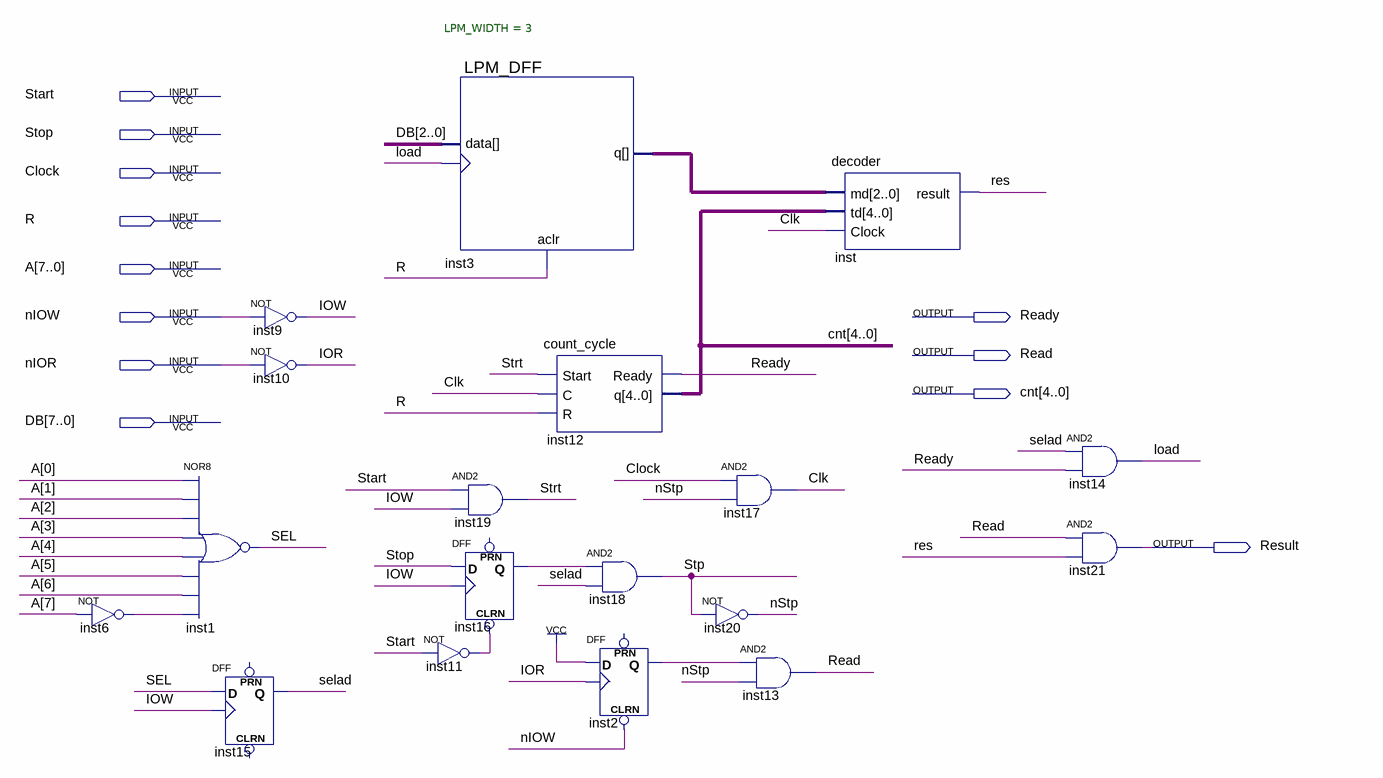
[diagram p0: schematic sheet]
// Quartus schematic interface.bdf as structural Verilog: 18 symbols, 12 pins
module \interface  (
  input  Start,
  input  Stop,
  input  Clock,
  input  R,
  input  [7:0] A,
  input  nIOW,
  input  nIOR,
  input  [7:0] DB,
  output Ready,
  output Read,
  output [4:0] cnt,
  output Result
);

  wire Clk, inst2_q, inst6_out, inst11_out, inst16_q, IOR, IOW, load, nStp, res, SEL, selad, Stp, Strt;
  wire [2:0] inst3_q;

  not inst6 (inst6_out, A[7]);
  nor inst1 (SEL, A[0], A[1], A[2], A[3], A[4], A[5], A[6], inst6_out);
  DFF inst15 (.CLK(IOW), .D(SEL), .Q(selad));  // open: CLRN, PRN
  not inst9 (IOW, nIOW);
  not inst10 (IOR, nIOR);
  LPM_DFF #(.LPM_WIDTH(3)) inst3 (.aclr(R), .clock(load), .data(DB[2:0]), .q(inst3_q));
  and inst19 (Strt, Start, IOW);
  DFF inst16 (.CLRN(inst11_out), .CLK(IOW), .D(Stop), .Q(inst16_q));  // open: PRN
  not inst11 (inst11_out, Start);
  count_cycle inst12 (.Start(Strt), .C(Clk), .R(R), .Ready(Ready), .q(cnt));
  and inst18 (Stp, inst16_q, selad);
  DFF inst2 (.CLRN(nIOW), .CLK(IOR), .D(1'b1), .Q(inst2_q));  // open: PRN
  not inst20 (nStp, Stp);
  and inst17 (Clk, Clock, nStp);
  and inst13 (Read, inst2_q, nStp);
  decoder inst (.md(inst3_q), .td(cnt), .Clock(Clk), .result(res));
  and inst14 (load, selad, Ready);
  and inst21 (Result, Read, res);
endmodule
